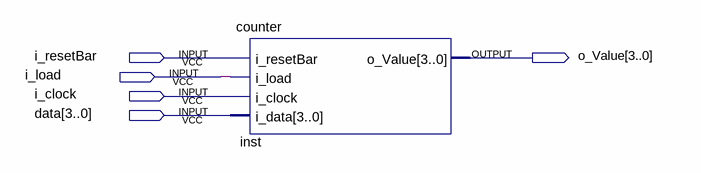
[diagram p0: schematic sheet]
// Quartus schematic counter.bdf as structural Verilog: 1 symbols, 5 pins
module counter (
  input  i_resetBar,
  input  i_load,
  input  i_clock,
  input  [3:0] data,
  output [3:0] o_Value
);

  counter inst (.i_resetBar(i_resetBar), .i_load(i_load), .i_clock(i_clock), .i_data(data), .o_Value(o_Value));
endmodule
